# EasyEDA schematic SCH_Handheld-arduino-game-console_2025-06-15.json
TITLE: Simple handheld arduino game console; REV: 1.1; Date: 2025-06-15; Sheet: 1/1; Company: https://github.com/Kaan1656
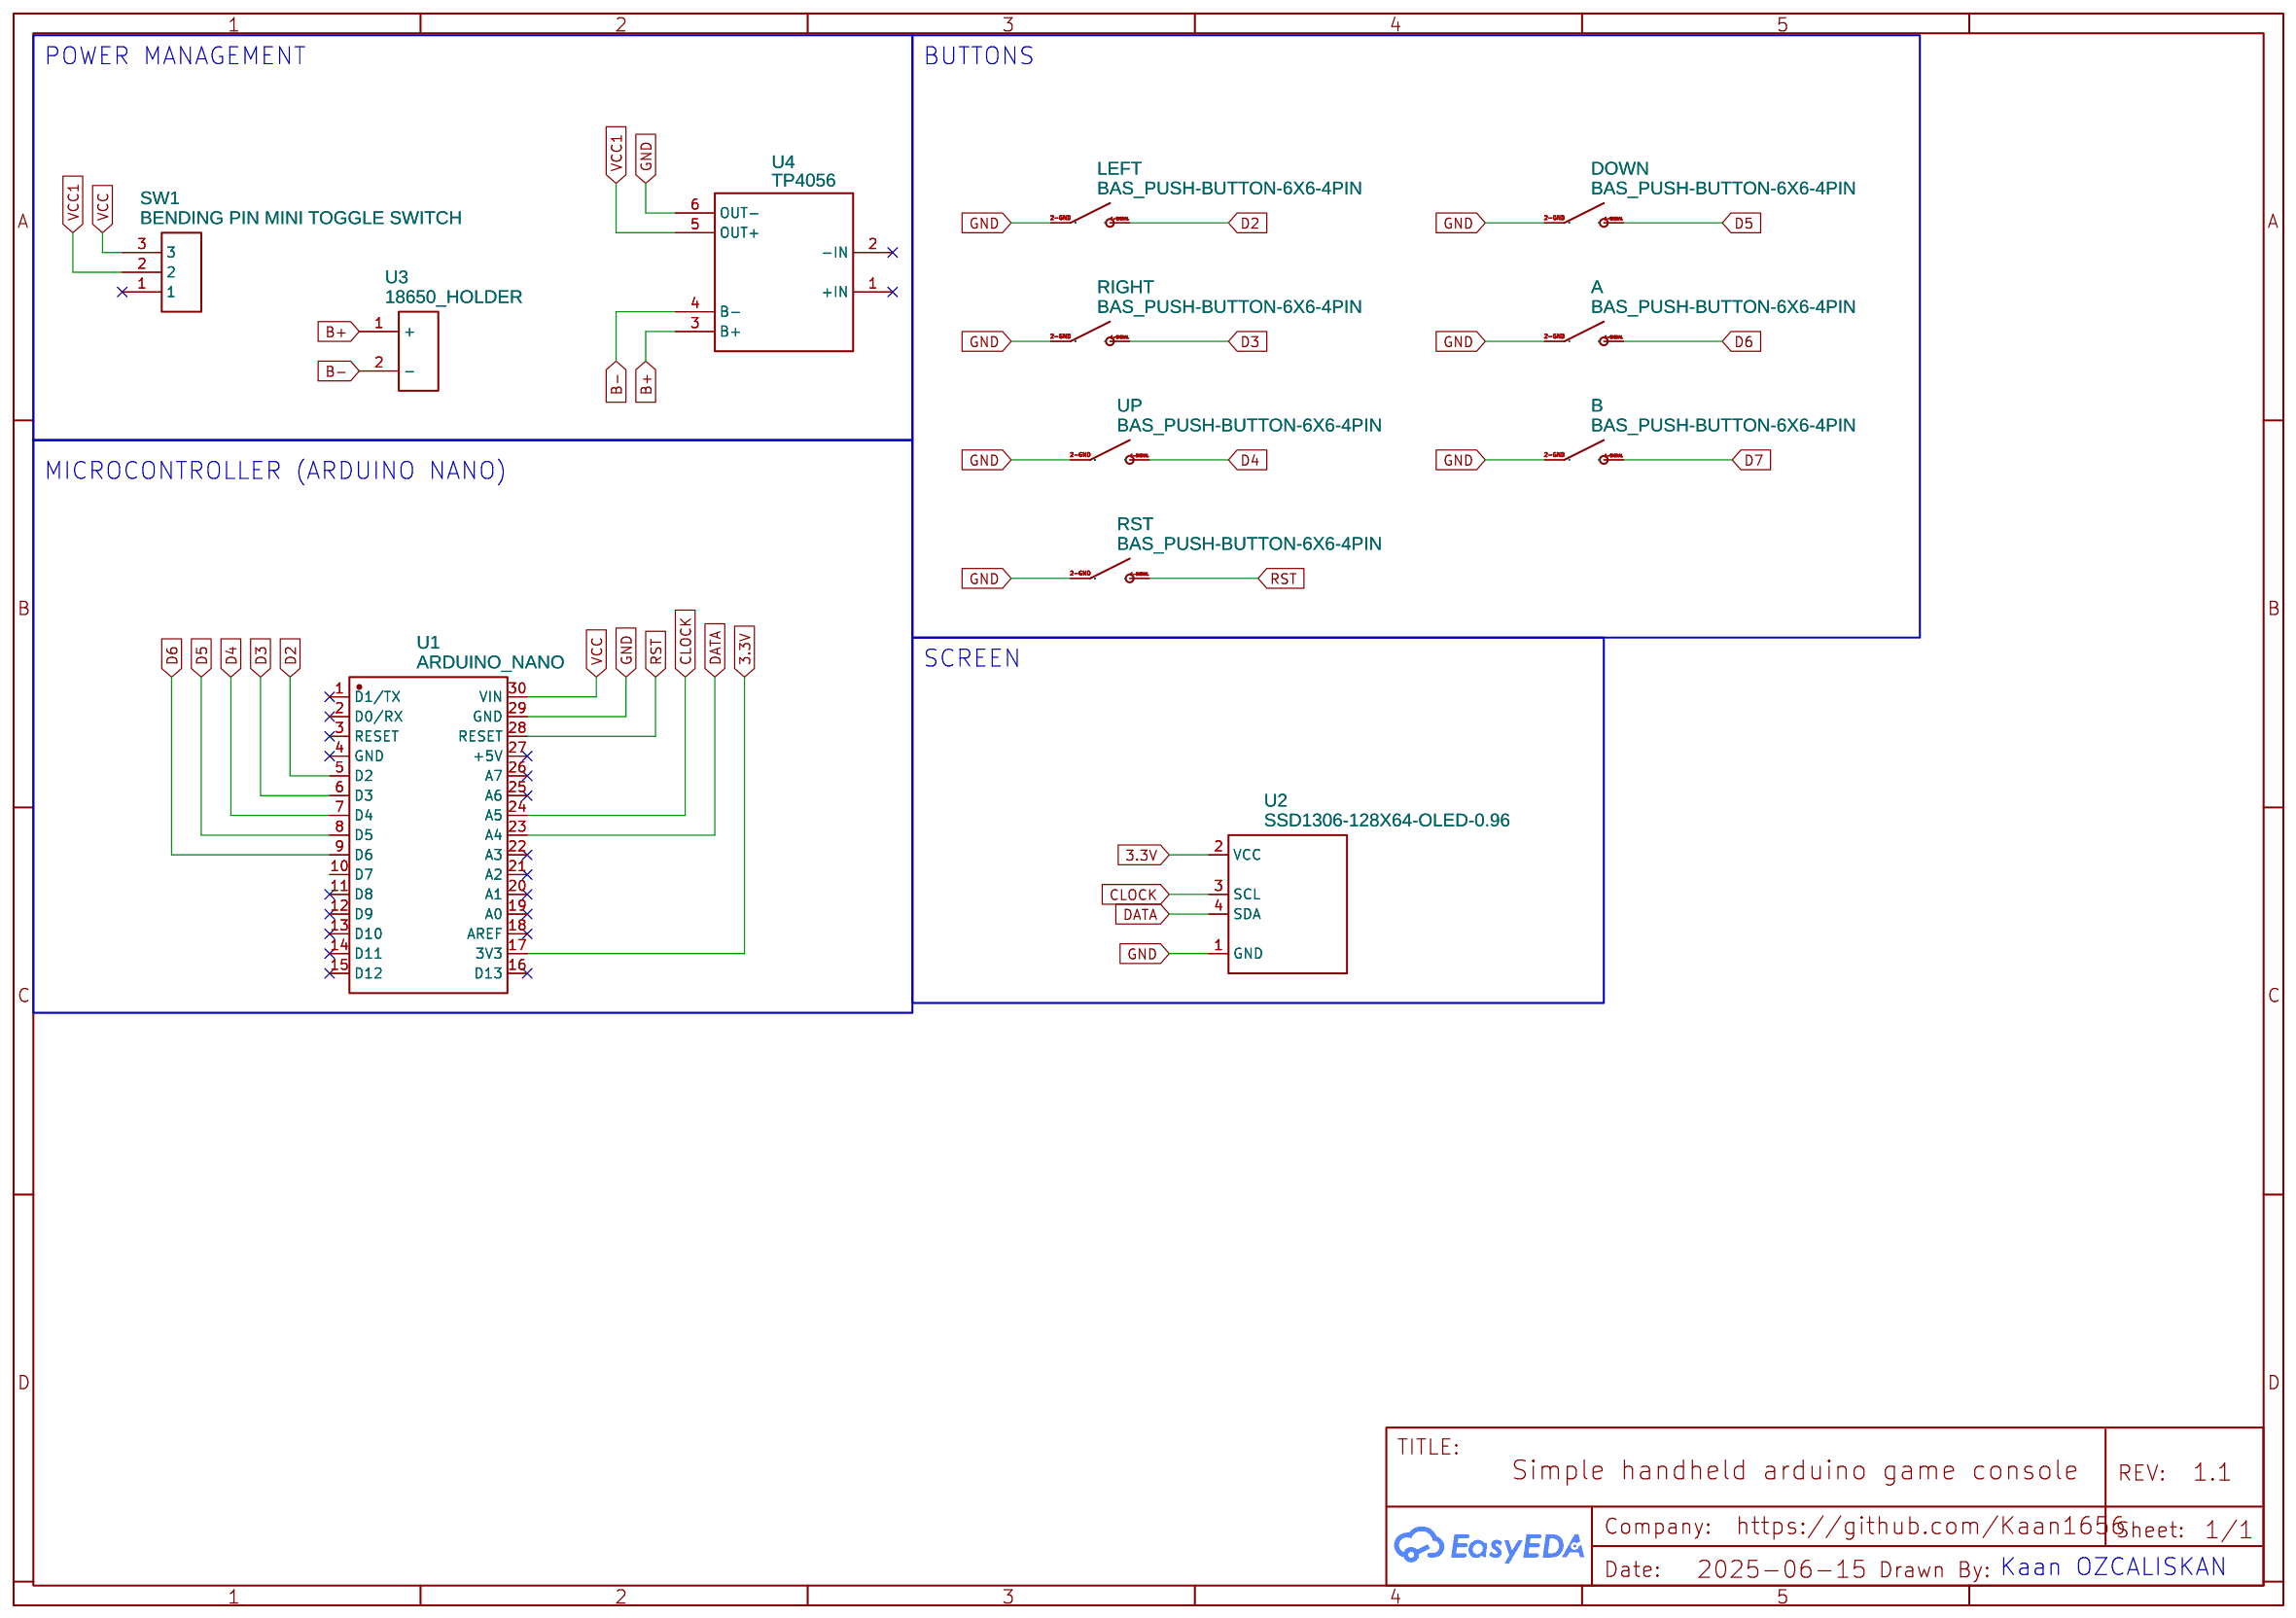
[diagram p0: schematic sheet]

## Parts
A  BAS_PUSH-BUTTON-6X6-4PIN  [PUSH-BUTTON-6X6-4PIN-FP]
B  BAS_PUSH-BUTTON-6X6-4PIN  [PUSH-BUTTON-6X6-4PIN-FP]
DOWN  BAS_PUSH-BUTTON-6X6-4PIN  [PUSH-BUTTON-6X6-4PIN-FP]
LEFT  BAS_PUSH-BUTTON-6X6-4PIN  [PUSH-BUTTON-6X6-4PIN-FP]
RIGHT  BAS_PUSH-BUTTON-6X6-4PIN  [PUSH-BUTTON-6X6-4PIN-FP]
RST  BAS_PUSH-BUTTON-6X6-4PIN  [PUSH-BUTTON-6X6-4PIN-FP]
SW1  BENDING PIN MINI TOGGLE SWITCH  [BENDING PIN MINI TOGGLE SWITCH (1P2T) SPDT SLIDE SWITCH 50V]
U1  ARDUINO_NANO  [COMM-TH_ARDUINO_NANO]
U2  SSD1306-128X64-OLED-0.96  [SSD1306]
U3  18650_HOLDER  [MY-18650-02_18650]
U4  TP4056  [TP4056]
UP  BAS_PUSH-BUTTON-6X6-4PIN  [PUSH-BUTTON-6X6-4PIN-FP]

## Library data of the parts
A B DOWN LEFT RIGHT RST UP = BAS_PUSH-BUTTON-6X6-4PIN: Manufacturer Part: Tact Push Button Micro Switch 6x6 4PIN; link: Tact micro button 6x6 4 pin; Contributor: mickleuk
SW1 = BENDING PIN MINI TOGGLE SWITCH (1P2T) SPDT SLIDE SWITCH GUKI: Manufacturer: Dongguan Kaifeng Electronic Technology Limited; Manufacturer Part: SS12D06; Supplier Part: SS12D06; link: https://www.alibaba.com/product-detail/KaiFeng-SS12D06-Three-Wrestling-Pin-Slide_62168688714.html?spm=a2700.7724838.2017115.14.2697ec44KNew8q; Contributor: nixoncali614; Link: https://www.alibaba.com/product-detail/KaiFeng-SS12D06-Three-Wrestling-Pin-Slide_62168688714.html?spm=a2700.7724838.2017115.14.2697ec44KNew8q; Price: $0.06; Package Display: No
U1 = ARDUINO_NANO: Contributor: lcsc; Supplier: LCSC; Supplier Part: C9900017879; Manufacturer: null; JLCPCB Part Class: Extended Part
U2 = SSD1306-128X64-OLED-0.96: sourceId: wICUcuL3l; Contributor: Think Service
U3 = 18650_HOLDER: Contributor: clement_6601
U4 = TP4056: Supplier: TZT Official Store; Contributor: ghj163

## Nets
3.3V: U1.17(3V3) U2.2(VCC)
GND: A.2-GND(2) B.2-GND(2) DOWN.2-GND(2) LEFT.2-GND(2) RIGHT.2-GND(2) RST.2-GND(2) U1.29(GND) U2.1(GND) U4.6(OUT-) UP.2-GND(2)
VCC: SW1.3 U1.30(VIN)
VCC1: SW1.2 U4.5(OUT+)
B+: U3.1(+) U4.3(B+)
B-: U3.2(-) U4.4(B-)
CLOCK: U1.24(A5) U2.3(SCL)
D2: LEFT.1-SIGNAL(1) U1.5(D2)
D3: RIGHT.1-SIGNAL(1) U1.6(D3)
D4: U1.7(D4) UP.1-SIGNAL(1)
D5: DOWN.1-SIGNAL(1) U1.8(D5)
D6: A.1-SIGNAL(1) U1.9(D6)
D7: B.1-SIGNAL(1)
DATA: U1.23(A4) U2.4(SDA)
RST: RST.1-SIGNAL(1) U1.28(RESET)

Not connected (* = marked no-connect by the designer): SW1 1*; U1 1(D1/TX)* 2(D0/RX)* 3(RESET)* 4(GND)* 10(D7) 11(D8)* 12(D9)* 13(D10)* 14(D11)* 15(D12)* 16(D13)* 18(AREF)* 19(A0)* 20(A1)* 21(A2)* 22(A3)* 25(A6)* 26(A7)* 27(+5V)*; U4 1(+IN)* 2(-IN)*

## Notes on the sheet
- POWER MANAGEMENT
- BUTTONS
- MICROCONTROLLER (ARDUINO NANO)
- SCREEN
- Kaan OZCALISKAN
